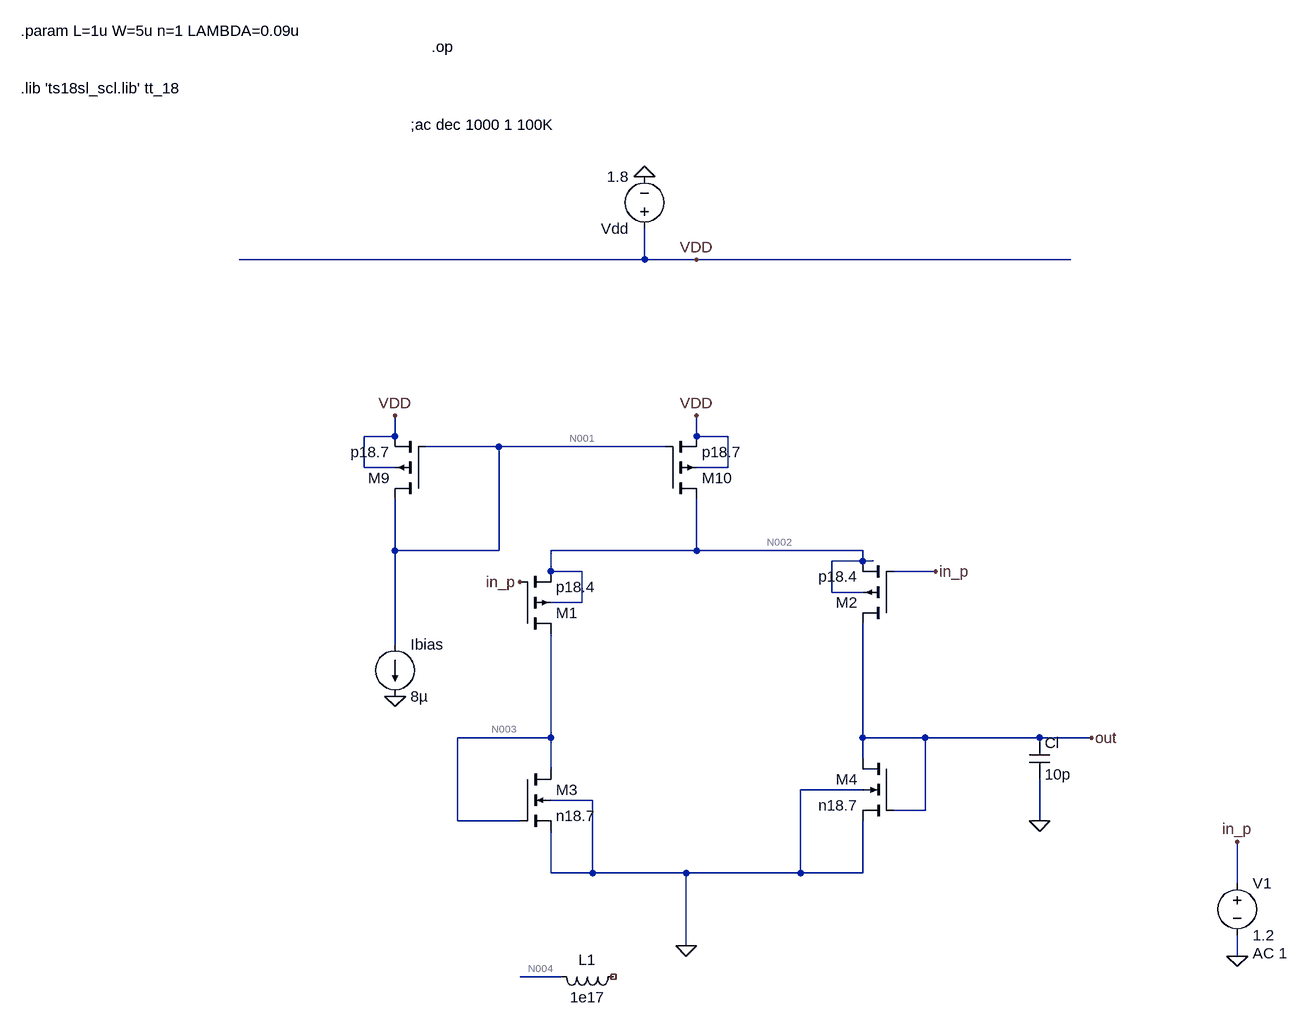
[diagram p0: schematic two_stage3--.asc]
two_stage3--.asc, the LTspice schematic file:
Version 4
SHEET 1 3032 1476
WIRE 432 80 432 32
WIRE 432 80 -192 80
WIRE 512 80 432 80
WIRE 1088 80 512 80
WIRE 48 352 48 320
WIRE 48 352 0 352
WIRE 512 352 512 320
WIRE 560 352 512 352
WIRE 208 368 96 368
WIRE 464 368 208 368
WIRE 0 400 0 352
WIRE 48 400 0 400
WIRE 560 400 560 352
WIRE 560 400 512 400
WIRE 48 528 48 448
WIRE 208 528 208 368
WIRE 208 528 48 528
WIRE 512 528 512 448
WIRE 512 528 288 528
WIRE 768 528 512 528
WIRE 768 544 768 528
WIRE 768 544 720 544
WIRE 784 544 768 544
WIRE 288 560 288 528
WIRE 336 560 288 560
WIRE 880 560 816 560
WIRE 720 592 720 544
WIRE 768 592 720 592
WIRE 336 608 336 560
WIRE 336 608 288 608
WIRE 48 672 48 528
WIRE 288 816 288 656
WIRE 288 816 144 816
WIRE 768 816 768 640
WIRE 864 816 768 816
WIRE 1040 816 864 816
WIRE 1120 816 1040 816
WIRE 768 848 768 816
WIRE 288 864 288 816
WIRE 768 896 672 896
WIRE 352 912 288 912
WIRE 864 928 864 816
WIRE 864 928 816 928
WIRE 144 944 144 816
WIRE 240 944 144 944
WIRE 1040 944 1040 880
WIRE 288 1024 288 960
WIRE 352 1024 352 912
WIRE 352 1024 288 1024
WIRE 496 1024 352 1024
WIRE 672 1024 672 896
WIRE 672 1024 496 1024
WIRE 768 1024 768 944
WIRE 768 1024 672 1024
WIRE 1344 1040 1344 976
WIRE 496 1136 496 1024
WIRE 1344 1152 1344 1120
WIRE 304 1184 240 1184
FLAG 48 752 0
FLAG 1120 816 out
FLAG 1040 944 0
FLAG 1344 1152 0
FLAG 1344 976 in_p
FLAG 496 1136 0
FLAG 512 80 VDD
FLAG 48 320 VDD
FLAG 512 320 VDD
FLAG 432 -48 0
FLAG 880 560 in_p
FLAG 240 576 in_p
SYMBOL nmos4 816 848 M0
SYMATTR InstName M4
SYMATTR Value n18.7
SYMATTR Value2 l=0.5u w=25u
SYMBOL voltage 432 48 R180
WINDOW 123 0 0 Left 0
WINDOW 39 0 0 Left 0
SYMATTR InstName Vdd
SYMATTR Value 1.8
SYMBOL pmos4 464 448 M180
SYMATTR InstName M10
SYMATTR Value p18.7
SYMATTR Value2 l=0.48u w=0.16u
SYMBOL pmos4 96 448 R180
SYMATTR InstName M9
SYMATTR Value p18.7
SYMATTR Value2 l=0.48u w=0.16u
SYMBOL nmos4 240 864 R0
SYMATTR InstName M3
SYMATTR Value n18.7
SYMATTR Value2 l=0.5u w=25u
SYMBOL pmos4 240 656 M180
SYMATTR InstName M1
SYMATTR Value p18.4
SYMATTR Value2 l=1u w=3u
SYMBOL pmos4 816 640 R180
SYMATTR InstName M2
SYMATTR Value p18.4
SYMATTR Value2 l=1u w=3u
SYMBOL current 48 672 R0
WINDOW 123 0 0 Left 0
WINDOW 39 0 0 Left 0
SYMATTR InstName Ibias
SYMATTR Value 8µ
SYMBOL cap 1024 816 R0
SYMATTR InstName Cl
SYMATTR Value 10p
SYMBOL voltage 1344 1024 R0
WINDOW 123 24 124 Left 2
WINDOW 39 0 0 Left 0
SYMATTR Value2 AC 1
SYMATTR InstName V1
SYMATTR Value 1.2
SYMBOL ind 400 1168 R90
WINDOW 0 5 56 VBottom 2
WINDOW 3 32 56 VTop 2
SYMATTR InstName L1
SYMATTR Value 1e17
TEXT -528 -184 Left 2 !.lib 'ts18sl_scl.lib' tt_18
TEXT -528 -272 Left 2 !.param L=1u W=5u n=1 LAMBDA=0.09u
TEXT 104 -248 Left 2 !.op
TEXT 72 -128 Left 2 !;ac dec 1000 1 100K

The netlist it stands for:
* two_stage3--.asc
M4 out out 0 0 n18.7 l=0.5u w=25u
Vdd VDD 0 1.8
M10 N002 N001 VDD VDD p18.7 l=0.48u w=0.16u
M9 N001 N001 VDD VDD p18.7 l=0.48u w=0.16u
M3 N003 N003 0 0 n18.7 l=0.5u w=25u
M1 N003 in_p N002 N002 p18.4 l=1u w=3u
M2 out in_p N002 N002 p18.4 l=1u w=3u
Ibias N001 0 8µ
Cl out 0 10p
V1 in_p 0 1.2 AC 1
L1 NC_01 N004 1e17
.model NMOS NMOS
.model PMOS PMOS
.lib standard.mos
.lib 'ts18sl_scl.lib' tt_18
.param L=1u W=5u n=1 LAMBDA=0.09u
.op
;ac dec 1000 1 100K
.backanno
.end

* Results of the author's LTspice run, read from the files saved beside the schematic
* Operating Point:
*   V(out) = 317.9 mV
*   V(vdd) = 1.8 V
*   V(n002) = 1.71 V
*   V(n001) = 6.494 mV
*   V(n003) = 317.9 mV
*   V(in_p) = 1.2 V
*   V(n004) = 0 V
*   Id(M2) = -567.4 nA
*   Ig(M2) = 0 A
*   Ib(M2) = 1.592 pA
*   Is(M2) = 567.4 nA
*   Id(M1) = -567.4 nA
*   Ig(M1) = 0 A
*   Ib(M1) = 1.592 pA
*   Is(M1) = 567.4 nA
*   Id(M9) = -8 µA
*   Ig(M9) = 0 A
*   Ib(M9) = 1.804 pA
*   Is(M9) = 8 µA
*   Id(M10) = -1.135 µA
*   Ig(M10) = 0 A
*   Ib(M10) = 99.79 fA
*   Is(M10) = 1.135 µA
*   Id(M3) = 567.4 nA
*   Ig(M3) = 0 A
*   Ib(M3) = -327.9 fA
*   Is(M3) = -567.4 nA
*   Id(M4) = 567.4 nA
*   Ig(M4) = 0 A
*   Ib(M4) = -327.9 fA
*   Is(M4) = -567.4 nA
*   I(Cl) = 0 A
*   I(L1) = 0 A
*   I(Ibias) = 8 µA
*   I(V1) = 0 A
*   I(Vdd) = -9.135 µA
* From the log:
*   Semiconductor Device Operating Points:
*                           --- BSIM3 MOSFETS ---
*   Name:        m2          m1          m9          m10         m3
*   Model:      p18.4       p18.4       p18.7       p18.7       n18.7
*   Id:       -5.67e-07   -5.67e-07   -8.00e-06   -1.13e-06    5.67e-07
*   Vgs:      -5.10e-01   -5.10e-01   -1.79e+00   -1.79e+00    3.18e-01
*   Vds:      -1.39e+00   -1.39e+00   -1.79e+00   -9.02e-02    3.18e-01
*   Vbs:       9.02e-02    9.02e-02    0.00e+00    0.00e+00    0.00e+00
*   Vth:      -4.42e-01   -4.42e-01   -4.30e-01   -4.32e-01    4.50e-01
*   Vdsat:    -9.43e-02   -9.43e-02   -1.15e+00   -1.15e+00    4.13e-02
*   Gm:        9.16e-06    9.16e-06    1.01e-05    5.87e-07    1.59e-05
*   Gds:       9.46e-09    9.46e-09    3.24e-07    1.21e-05    7.42e-08
*   Gmb        2.67e-06    2.67e-06    4.09e-06    3.92e-07    3.82e-06
*   Cbd:       0.00e+00    0.00e+00    0.00e+00    0.00e+00    0.00e+00
*   Cbs:       0.00e+00    0.00e+00    0.00e+00    0.00e+00    0.00e+00
*   Cgsov:     7.80e-16    7.80e-16    4.16e-17    4.16e-17    5.50e-15
*   Cgdov:     7.80e-16    7.80e-16    4.16e-17    4.16e-17    5.50e-15
*   Cgbov:     0.00e+00    0.00e+00    0.00e+00    0.00e+00    0.00e+00
*   dQgdVgb:   1.82e-14    1.82e-14    6.33e-16    7.43e-16    5.42e-14
*   dQgdVdb:  -7.80e-16   -7.80e-16   -4.15e-17   -3.50e-16   -5.53e-15
*   dQgdVsb:  -1.41e-14   -1.41e-14   -5.82e-16   -3.88e-16   -2.91e-14
*   dQddVgb:  -7.10e-15   -7.10e-15   -2.62e-16   -3.70e-16   -1.70e-14
*   dQddVdb:   7.80e-16    7.80e-16    4.16e-17    3.46e-16    5.53e-15
*   dQddVsb:   8.27e-15    8.27e-15    2.83e-16    1.14e-16    1.45e-14
*   dQbdVgb:  -4.03e-15   -4.03e-15   -1.10e-16   -2.56e-18   -2.02e-14
*   dQbdVdb:  -2.05e-19   -2.05e-19   -1.21e-19   -3.01e-16   -2.56e-17
*   dQbdVsb:  -3.25e-15   -3.25e-15   -2.68e-17    1.18e-16   -5.28e-15
*   Name:        m4
*   Model:      n18.7
*   Id:        5.67e-07
*   Vgs:       3.18e-01
*   Vds:       3.18e-01
*   Vbs:       0.00e+00
*   Vth:       4.50e-01
*   Vdsat:     4.13e-02
*   Gm:        1.59e-05
*   Gds:       7.42e-08
*   Gmb        3.82e-06
*   Cbd:       0.00e+00
*   Cbs:       0.00e+00
*   Cgsov:     5.50e-15
*   Cgdov:     5.50e-15
*   Cgbov:     0.00e+00
*   dQgdVgb:   5.42e-14
*   dQgdVdb:  -5.53e-15
*   dQgdVsb:  -2.91e-14
*   dQddVgb:  -1.70e-14
*   dQddVdb:   5.53e-15
*   dQddVsb:   1.45e-14
*   dQbdVgb:  -2.02e-14
*   dQbdVdb:  -2.56e-17
*   dQbdVsb:  -5.28e-15